# EAGLE design BipolarDAC_16-bit_v01 (EAGLE 8.2.1)
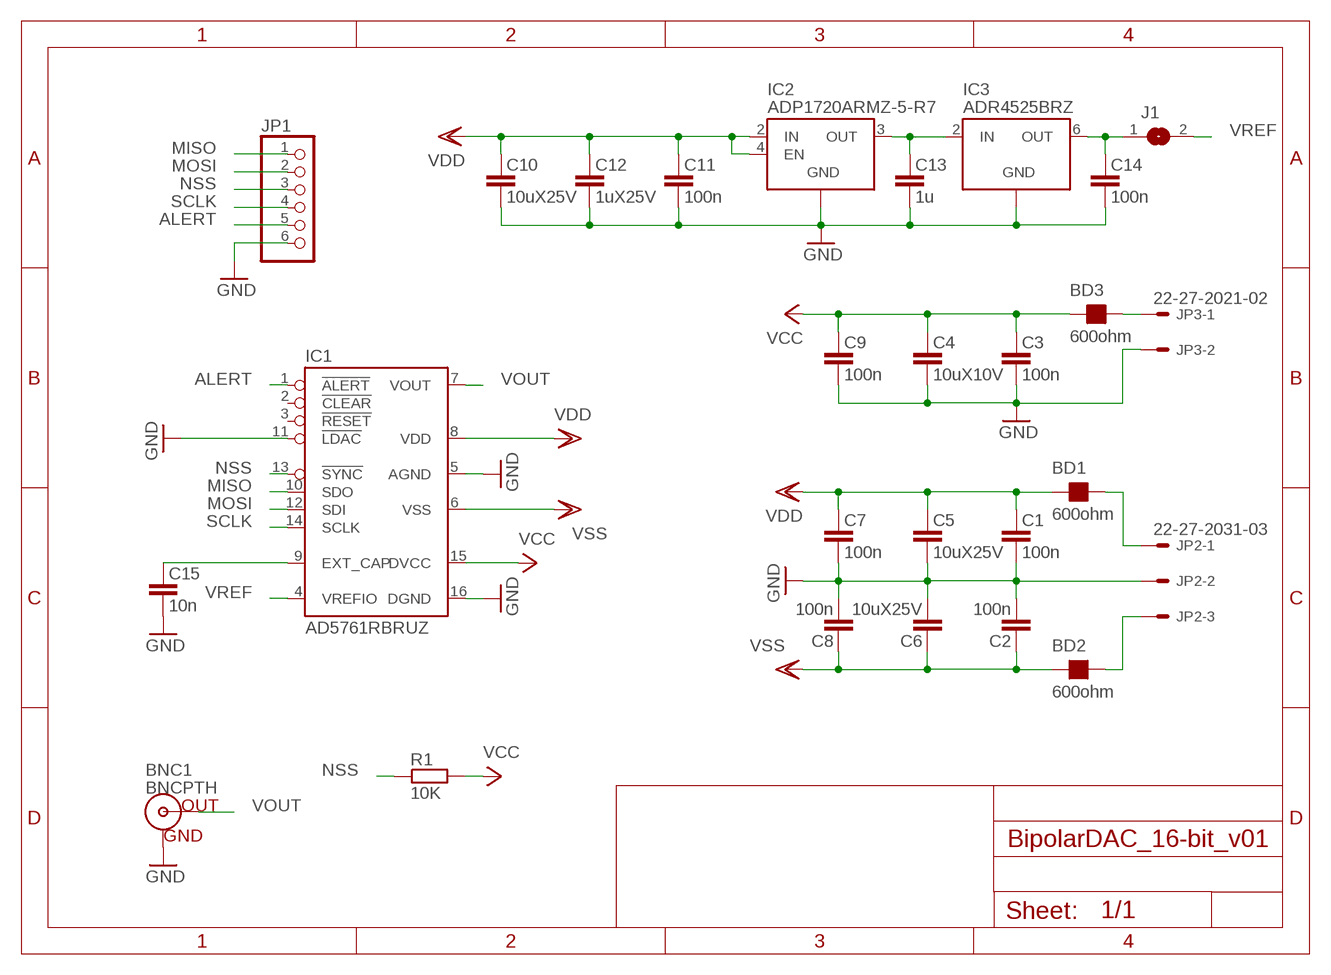
[diagram p0: schematic, sheet 1]

## Parts
BD1  600ohm  FB_0805  [L0805]
BD2  600ohm  FB_0805  [L0805]
BD3  600ohm  FB_0805  [L0805]
BNC1  BNCPTH  [BNC]
C1  100n  C_EU_C0603G  [C0603G]
C2  100n  C_EU_C0603G  [C0603G]
C3  100n  C_EU_C0402G  [C0402G]
C4  10uX10V  C_EU_C0805G  [C0805G]
C5  10uX25V  C_EU_C1206G  [C1206G]
C6  10uX25V  C_EU_C1206G  [C1206G]
C7  100n  C_EU_C0603G  [C0603G]
C8  100n  C_EU_C0603G  [C0603G]
C9  100n  C_EU_C0402G  [C0402G]
C10  10uX25V  C_EU_C1206G  [C1206G]
C11  100n  C_EU_C0603G  [C0603G]
C12  1uX25V  C_EU_C0603G  [C0603G]
C13  1u  C_EU_C0603G  [C0603G]
C14  100n  C_EU_C0603G  [C0603G]
C15  10n  C_EU_C0603G  [C0603G]
IC1  AD5761RBRUZ  [TSSOP16]
IC2  ADP1720ARMZ-5-R7  [MSOP8]
IC3  ADR4525BRZ  [SOIC-8]
J1  SJS  [SJS]
JP1  PINHD-1X6  [1X06]
JP2  22-27-2031-03  [6410-03]
JP3  22-27-2021-02  [6410-02]
R1  10K  R_EU_R0603G  [R0603G]

## Nets
5VOUT: C13.1 IC2.3(OUT) IC3.2(IN)
ALERT: IC1.1(!ALERT) JP1.5
GND: BNC1.GND C1.2 C2.2 C3.2 C4.2 C5.2 C6.2 C7.2 C8.2 C9.2 C10.2 C11.2 C12.2 C13.2 C14.2 C15.2 IC1.5(AGND) IC1.11(!LDAC) IC1.16(DGND) IC2.1(GND) IC2.5(GND) IC2.6(GND) IC2.7(GND) IC2.8(GND) IC3.4(GND) JP1.6 JP2.2 JP3.2
MISO: IC1.10(SDO) JP1.1
MOSI: IC1.12(SDI) JP1.2
N$1: C15.1 IC1.9(EXT_CAP)
NSS: IC1.13(!SYNC) JP1.3 R1.1
SCLK: IC1.14(SCLK) JP1.4
VCC: BD3.1 C3.1 C4.1 C9.1 IC1.15(DVCC) R1.2
VCC_IN: BD3.2 JP3.1
VDD: BD1.1 C1.1 C5.1 C7.1 C10.1 C11.1 C12.1 IC1.8(VDD) IC2.2(IN) IC2.4(EN)
VDD_IN: BD1.2 JP2.1
VOUT: BNC1.S(OUT) IC1.7(VOUT)
VREF: IC1.4(VREFIO) J1.2
VREF_OUT: C14.1 IC3.6(OUT) J1.1
VSS: BD2.1 C2.1 C6.1 C8.1 IC1.6(VSS)
VSS_IN: BD2.2 JP2.3
Unconnected: IC1.2(!CLEAR) IC1.3(!RESET)

## Library data of the parts
BD1-BD3 = SmartMDC:FB_: FERRITE BEAD
BNC1 = SmartMDC:BNC: BNC Connector, Mouser Part# 5227161
C1-C15 = SmartMDC:C_EU_
IC1 = SmartMDC:AD5761R: Multiple Range, 16-/12-Bit, Bipolar/Unipolar Voltage Output DACs with 2 ppm/°C Reference
IC2 = SmartMDC:ADP1720: ANALOG DEVICES 50 mA, High Voltage, Micropower Linear Regulator
IC3 = SmartMDC:ADR45*: ANALOG DEVICES Ultralow Noise, High Accuracy Voltage References
J1 = SmartMDC:SJ: SMD solder JUMPER
JP1 = SmartMDC:PINHD-1X6: PIN HEADER
JP2 = SmartMDC:22-?-03: CONNECTOR wire to board 2.54 mm (.1 inch) pitch header; OC_FARNELL: unknown; OC_NEWARK: unknown
JP3 = SmartMDC:22-?-02: CONNECTOR wire to board 2.54 mm (.1 inch) pitch header; OC_FARNELL: unknown; OC_NEWARK: unknown
R1 = SmartMDC:R_EU_

## Board
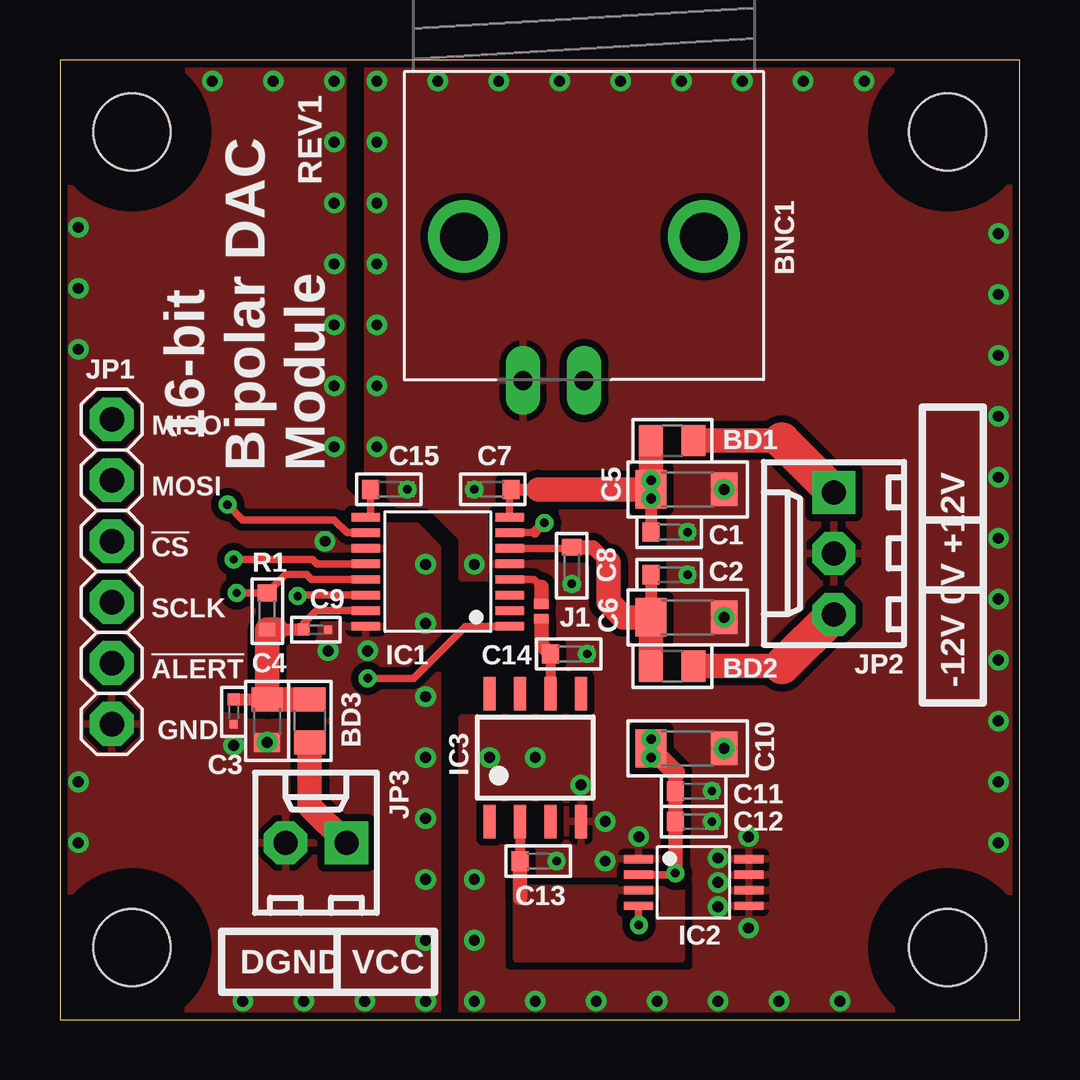
[diagram p1: board, top side]
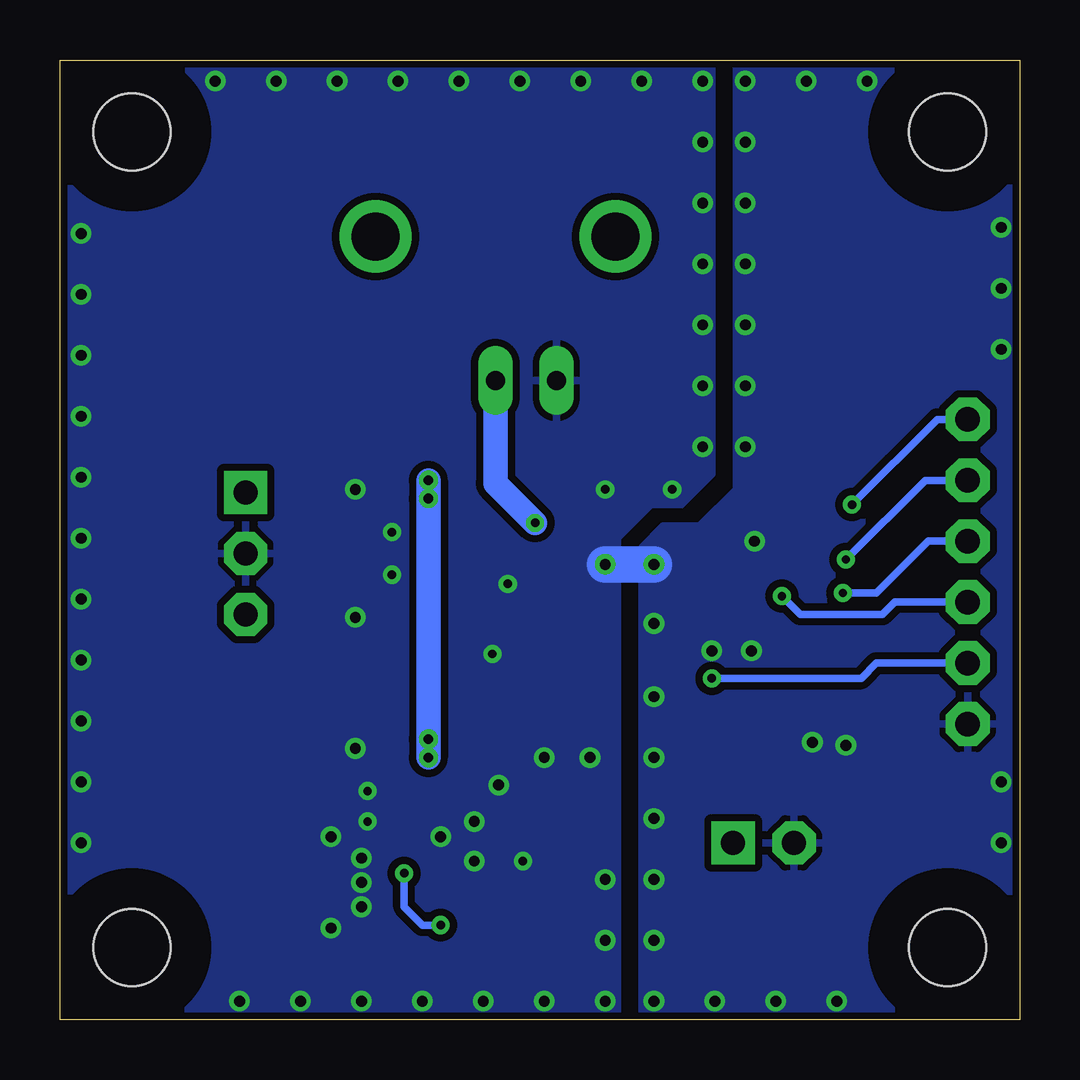
[diagram p2: board, bottom side, seen from below]

Size 40 x 40 mm. Coordinates in mm from the lower left corner, seen from the top.
Outline: 0,0 40,0 40,40 0,40 0,0
Copper layers (1*16): Top 0.035mm / dielectric 1.5mm / Bottom 0.035mm
Design rules "default *": minimum track width 8mil, minimum drill 0.3mm, track to track 8mil, track to pad 8mil, pad to pad 8mil, via to via 8mil, smd to smd 0mil, copper to edge 10mil, drill to drill 6mil, minimum pad ring 10mil, minimum via ring 8mil, stop-mask expansion 4mil, vias tented up to drill 24mil, thermal gap 10mil
Holes 3.2 mm at 3,37 37,37 3,3 37,3
tRestrict: area 0,0 to 6,6; area 34,0 to 40,6; area 34,34 to 40,40; area 0,34 to 6,40
bRestrict: area 0,34 to 6,40; area 34,34 to 40,40; area 34,0 to 40,6; area 0,0 to 6,6

### Footprints (pad centres in the part's own frame; a part is rotated, then mirrored left to right if it is on the bottom)
L0805 = smd 1 x 1.3: 1 -0.889,0; 2 0.889,0
BNC = drill 2: 3 -5,0; 4 5,0 | drill 0.8 long: GND -2.54,-6; S 0,-6
C0603G = smd 0.7 x 0.8: 1 -0.762,0 | smd 0.548 x 0.648: 2 0.762,0
C0402G = smd 0.5 x 0.5: 1 -0.508,0 | smd 0.348 x 0.348: 2 0.508,0
C0805G = smd 1 x 1.3: 1 -0.889,0 | smd 0.797 x 1.097: 2 0.889,0
C1206G = smd 1.3 x 1.6: 1 -1.524,0 | smd 1.097 x 1.397: 2 1.524,0
TSSOP16 = smd 0.35 x 1.2: 1 -2.275,-3; 2 -1.625,-3; 3 -0.975,-3; 4 -0.325,-3; 5 0.325,-3; 6 0.975,-3; 7 1.625,-3; 8 2.275,-3; 9 2.275,3; 10 1.625,3; 11 0.975,3; 12 0.325,3; 13 -0.325,3; 14 -0.975,3; 15 -1.625,3; 16 -2.275,3
MSOP8 = smd 0.35 x 1.2: 1 -0.975,-2.3; 2 -0.325,-2.3; 3 0.325,-2.3; 4 0.975,-2.3; 5 0.975,2.3; 6 0.325,2.3; 7 -0.325,2.3; 8 -0.975,2.3
SOIC-8 = smd 0.5 x 1.4: 1 -1.905,-2.667; 2 -0.635,-2.667; 3 0.635,-2.667; 4 1.905,-2.667; 5 1.905,2.667; 6 0.635,2.667; 7 -0.635,2.667; 8 -1.905,2.667
SJS = smd 0.406 x 0.61: 1 -0.305,0; 2 0.305,0
1X06 = drill 1.016 octagon: 1 -6.35,0; 2 -3.81,0; 3 -1.27,0; 4 1.27,0; 5 3.81,0; 6 6.35,0
6410-03 = drill 1 square: 1 2.54,0 | drill 1 octagon: 2 0,0; 3 -2.54,0
6410-02 = drill 1 square: 1 1.27,0 | drill 1 octagon: 2 -1.27,0
R0603G = smd 0.7 x 0.8: 1 -0.762,0 | smd 0.548 x 0.648: 2 0.762,0

### Placement (x,y rotation side)
BD1  25.53,24.13 0 top
BD2  25.53,14.73 0 top
BD3  10.41,12.45 270 top
BNC1  21.84,32.64 0 top
C1  25.4,20.32 0 top
C2  25.4,18.54 0 top
C3  7.24,12.83 270 top
C4  8.64,12.45 270 top
C5  26.16,22.1 0 top
C6  26.16,16.76 0 top
C7  18.03,22.1 180 top
C8  21.34,18.92 270 top
C9  10.67,16.26 0 top
C10  26.16,11.3 0 top
C11  26.42,9.53 0 top
C12  26.42,8.26 0 top
C13  19.94,6.6 0 top
C14  21.21,15.24 0 top
C15  13.72,22.1 0 top
IC1  15.75,18.67 90 top
IC2  26.42,5.71 270 top
IC3  19.81,10.92 0 top
J1  20.07,17.02 90 top
JP1  2.16,18.67 270 top
JP2  32.26,19.43 90 top
JP3  10.67,7.37 0 top
R1  8.64,17.02 270 top

### Tracks (layer width: path | path; a pad name or v marks a point on that pad's centre or on a via)
5VOUT
  Top 0.406: IC3.2 C13.1
  Top 0.61: C13.1 19.18,5.08
  pour Top (isolate 0.305): 19.02,5.46 25.91,5.46 25.91,2.54 19.02,2.54
ALERT  (via drill 0.35)
  Top 0.305: IC1.1 16.9,16.39 14.73,14.22 v12.83,14.22
  Bottom 0.305: v12.83,14.22 6.6,14.22 5.97,14.86 JP1.5
GND  (via drill 0.35, 0.45)
  Bottom 1.524: v15.24,18.97 v17.27,18.97
  other vias: 8.64,11.56 7.24,11.43 11.18,15.37 12.83,15.37 11.05,19.94 15.24,0.76 12.7,0.76 10.16,0.76 7.62,0.76 0.76,7.37 0.76,9.91 15.24,3.3 15.24,5.84 15.24,8.38 15.24,10.92 15.24,13.46 15.24,16.51 11.43,23.88 11.43,26.42 11.43,28.96 11.43,31.5 11.43,34.04 11.43,36.58 11.43,39.12 8.89,39.12 6.35,39.12 0.76,33.02 0.76,30.48 0.76,27.94 27.69,11.3 27.18,8.26 27.18,9.53 20.7,6.6 21.97,15.24 27.69,22.1 27.69,16.76 26.16,20.32 26.16,18.54 21.34,18.16 17.27,22.1 24.13,7.62 22.73,8.26 28.7,7.62 28.7,3.81 27.43,4.7 27.43,5.71 27.43,6.73 21.72,9.78 22.73,6.6 17.27,0.76 19.81,0.76 22.35,0.76 24.89,0.76 27.43,0.76 29.97,0.76 32.51,0.76 39.12,32.77 39.12,30.23 39.12,27.69 39.12,25.15 39.12,22.61 39.12,20.07 39.12,17.53 39.12,14.99 39.12,12.45 39.12,9.91 39.12,7.37 13.21,39.12 15.75,39.12 18.29,39.12 20.83,39.12 23.37,39.12 25.91,39.12 28.45,39.12 30.99,39.12 33.53,39.12 13.21,36.58 13.21,34.04 13.21,31.5 13.21,28.96 13.21,26.42 13.21,23.88 17.27,3.3 17.27,5.84 17.91,10.92 19.81,10.92 14.48,22.1
  pour Bottom (isolate 0.305, rank 6): 0,0 0,40 11.81,40 11.81,22.1 13.34,20.57 14.86,20.57 15.75,19.68 15.75,0
  pour Top (isolate 0.305, rank 6): 0,0 0,40 11.81,40 11.81,22.1 13.34,20.57 14.86,20.57 15.75,19.68 15.75,0
  pour Top (isolate 0.305, rank 6): 12.83,40 40,40 40,0 16.76,0 16.76,12.57 17.91,12.57 17.91,18.41 16.76,18.41 16.76,20.07 15.37,21.46 14.1,21.46 12.83,22.73
  pour Bottom (isolate 0.305, rank 6): 40,0 40,40 12.83,40 12.83,22.73 14.1,21.46 15.37,21.46 16.76,20.07 16.76,0
MISO  (via drill 0.35)
  Top 0.305: IC1.10 11.96,20.29 11.43,20.83 7.62,20.83 v6.99,21.46
  Bottom 0.305: JP1.1 3.43,25.02 v6.99,21.46
MOSI  (via drill 0.35)
  Top 0.305: IC1.12 10.72,18.99 10.54,19.18 v7.24,19.18
  Bottom 0.305: v7.24,19.18 3.94,22.48 JP1.2
N$1
  Top 0.305: IC1.9 12.95,20.94 C15.1
NSS  (via drill 0.35)
  Top 0.305: v7.37,17.78 R1.1 9.4,18.54 10.29,18.54 10.48,18.34 IC1.13
  Bottom 0.305: JP1.3 3.81,19.94 5.97,17.78 v7.37,17.78
SCLK  (via drill 0.35)
  Top 0.305: IC1.14 9.95,17.69 v9.91,17.65
  Bottom 0.305: JP1.4 5.21,17.4 5.71,16.89 9.14,16.89 v9.91,17.65
VCC
  Top 0.305: IC1.15 10.69,17.04 10.16,16.51 C9.1
  Top 0.508: C3.1 C4.1 | 9.02,16.26 C9.1
  Top 1.016: BD3.1 C4.1 R1.2 9.02,16.26
VCC_IN
  Top 1.016: BD3.2 10.41,8.89 JP3.1
VDD  (via drill 0.35, 0.4)
  Top 0.305: IC1.8 18.75,22.05 C7.1 | IC2.2 25.6,6.04 v25.65,6.1 | IC2.4 24.12,3.95 v24.13,3.94
  Top 0.508: C5.1 v24.64,21.72 C1.1 | C7.1 19.94,22.1
  Top 0.61: 25.65,10.29 C11.1 C12.1 v25.65,6.1
  Top 0.813: 25.65,10.29 C10.1 v24.64,11.68
  Top 1.016: BD1.1 v24.64,22.48 C5.1 19.94,22.1
  Bottom 0.305: v24.13,3.94 24.89,3.94 25.65,4.7 v25.65,6.1
  Bottom 1.016: v24.64,22.48 v24.64,21.72 v24.64,11.68 v24.64,10.92
VDD_IN
  Top 1.016: 30.1,24.13 BD1.2
  Top 1.524: JP2.1 30.1,24.13
VOUT  (via drill 0.35)
  Top 0.305: IC1.7 19.79,20.29
  Top 0.406: 19.79,20.29 v20.19,20.7
  Bottom 1.016: BNC1.S 21.84,22.35 v20.19,20.7
VREF
  Top 0.305: IC1.4 19.63,18.34 19.76,18.34 20.07,18.03 | J1.2 20.07,17.42
  Top 0.61: 20.07,17.42 20.07,18.03
VREF_OUT
  Top 0.305: J1.1 20.07,16.61
  Top 0.406: C14.1 IC3.6
  Top 0.61: C14.1 20.07,15.62 20.07,16.61
VSS
  Top 0.305: IC1.6 21.3,19.64 C8.1
  Top 0.508: C2.1 C6.1
  Top 0.61: C8.1 22.23,19.68 22.86,19.05
  Top 1.016: BD2.1 C6.1 23.5,16.76 22.86,17.4 22.86,19.05
VSS_IN
  Top 1.016: 30.1,14.73 BD2.2
  Top 1.524: JP2.3 30.1,14.73

### Text on the board
tPlace: REV1 | MISO | 16-bit / Bipolar DAC / Module | MOSI | !CS | SCLK | !ALERT | -12V 0V +12V | GND | DGND VCC
_tNames: BNC1 | JP1 | BD1 | C15 | C7 | C5 | C8 | C1 | R1 | C2 | C9 | IC1 | C14 | J1 | C6 | JP2 | C4 | BD3 | BD2 | C10 | C3 | JP3 | IC3 | C11 | C12 | C13 | IC2